# EAGLE design 7seg Display Controller_Rev00 (EAGLE 5.11)
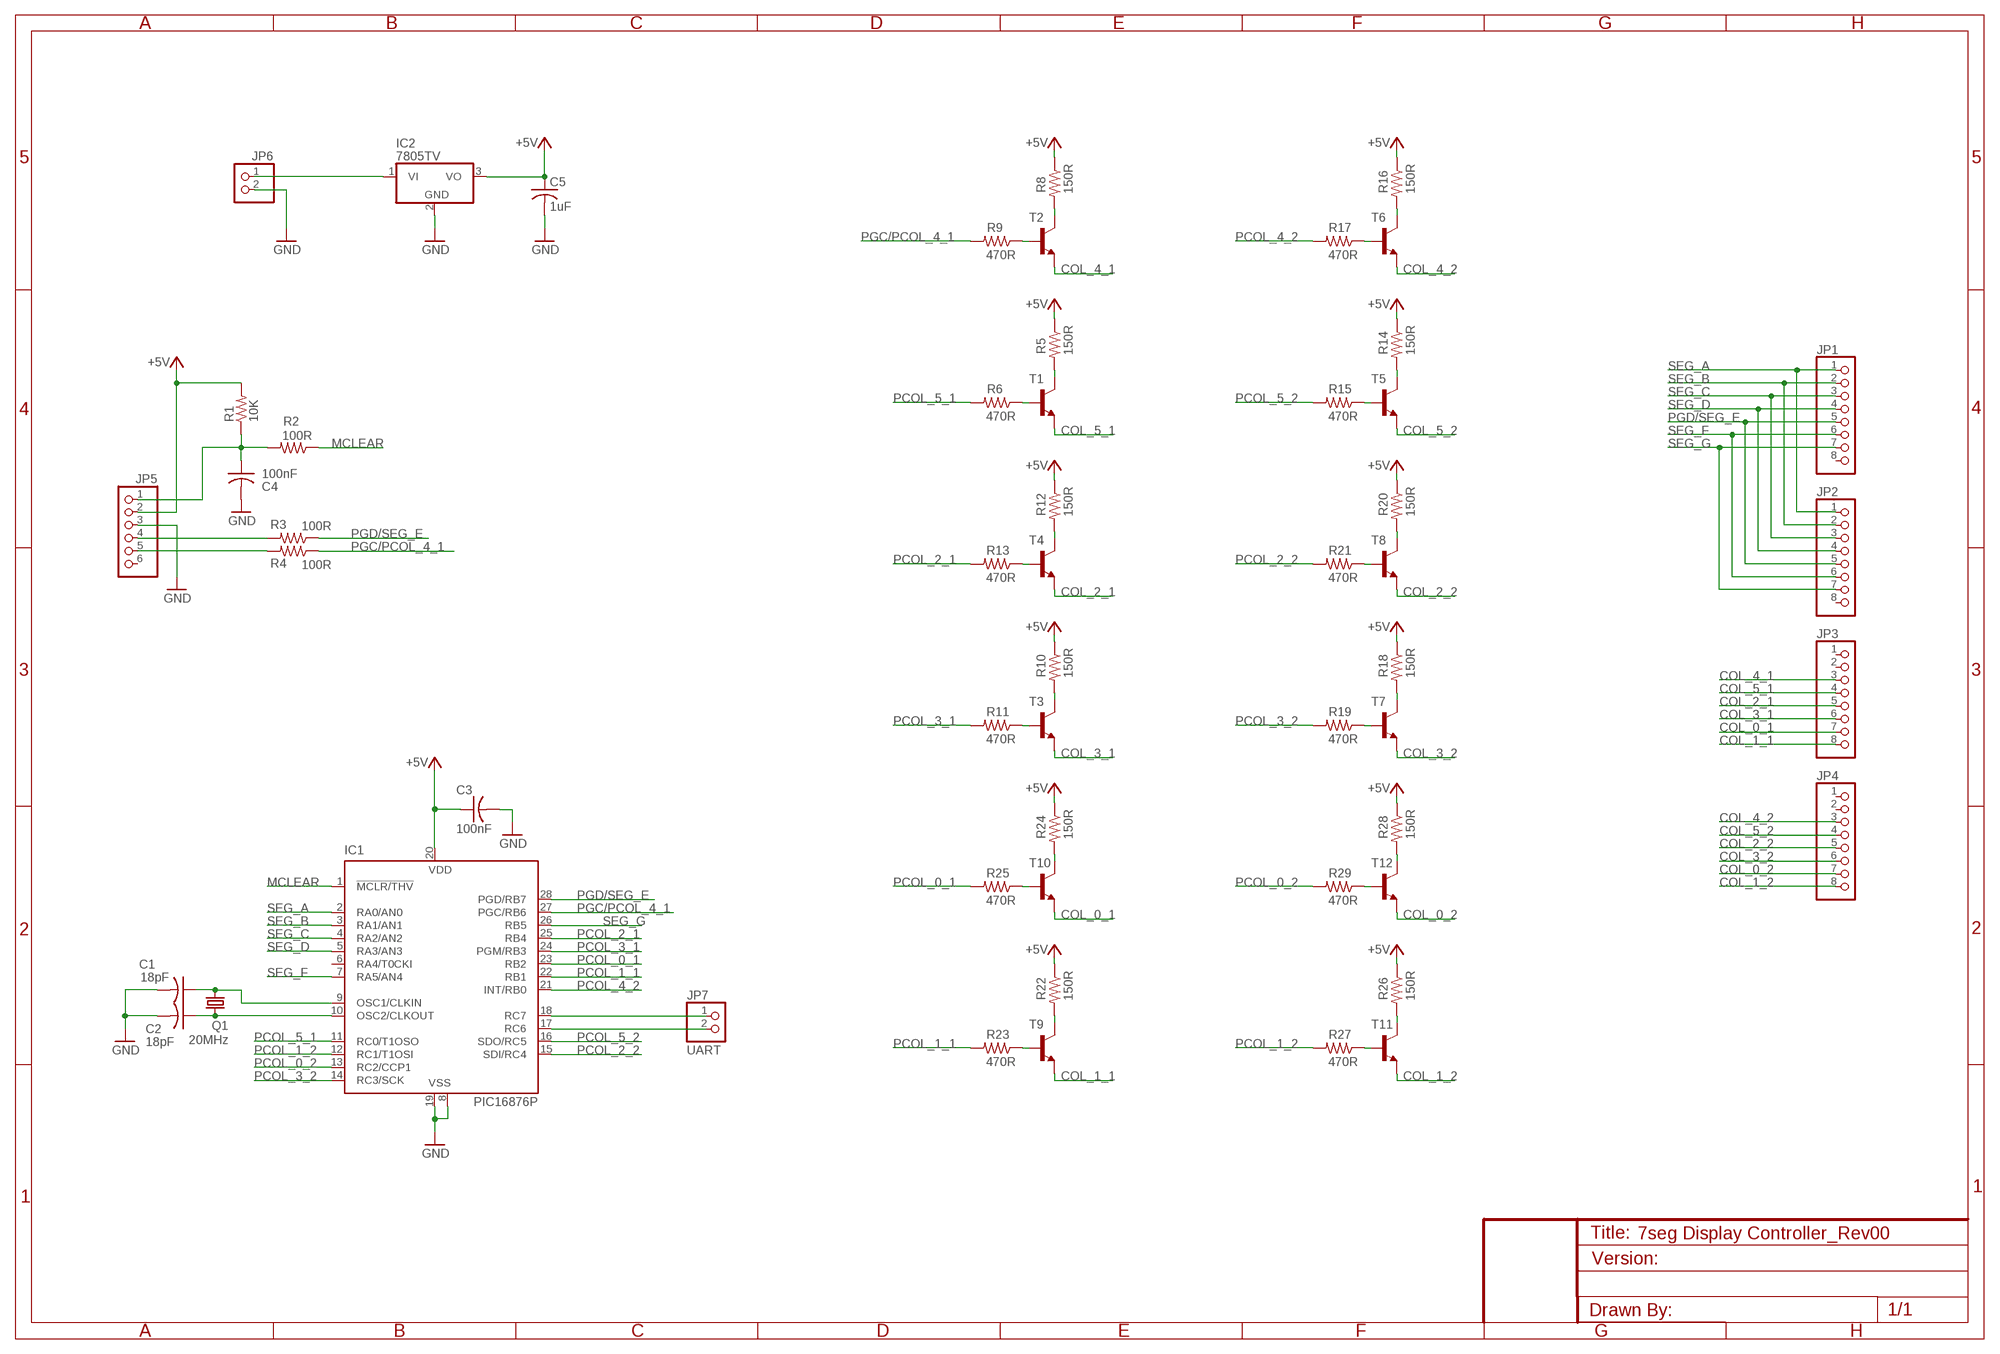
[diagram p0: schematic, sheet 1]

## Parts
C1  18pF  C-USC0805  [C0805]
C2  18pF  C-USC0805  [C0805]
C3  100nF  C-USC0805  [C0805]
C4  100nF  C-USC0805  [C0805]
C5  1uF  C-USC0805  [C0805]
IC1  PIC16876P  [DIL28-3]
IC2  7805TV  [TO220V]
JP1  PINHD-1X8  [1X08]
JP2  PINHD-1X8  [1X08]
JP3  PINHD-1X8  [1X08]
JP4  PINHD-1X8  [1X08]
JP5  PINHD-1X6  [1X06]
JP6  PINHD-1X2  [1X02]
JP7  UART  PINHD-1X2  [1X02]
Q1  20MHz  CRYSTALHC49S  [HC49/S]
R1  10K  R-US_R0805  [R0805]
R2  100R  R-US_R0805  [R0805]
R3  100R  R-US_R0805  [R0805]
R4  100R  R-US_R0805  [R0805]
R5  150R  R-US_R0805  [R0805]
R6  470R  R-US_R0805  [R0805]
R8  150R  R-US_R0805  [R0805]
R9  470R  R-US_R0805  [R0805]
R10  150R  R-US_R0805  [R0805]
R11  470R  R-US_R0805  [R0805]
R12  150R  R-US_R0805  [R0805]
R13  470R  R-US_R0805  [R0805]
R14  150R  R-US_R0805  [R0805]
R15  470R  R-US_R0805  [R0805]
R16  150R  R-US_R0805  [R0805]
R17  470R  R-US_R0805  [R0805]
R18  150R  R-US_R0805  [R0805]
R19  470R  R-US_R0805  [R0805]
R20  150R  R-US_R0805  [R0805]
R21  470R  R-US_R0805  [R0805]
R22  150R  R-US_R0805  [R0805]
R23  470R  R-US_R0805  [R0805]
R24  150R  R-US_R0805  [R0805]
R25  470R  R-US_R0805  [R0805]
R26  150R  R-US_R0805  [R0805]
R27  470R  R-US_R0805  [R0805]
R28  150R  R-US_R0805  [R0805]
R29  470R  R-US_R0805  [R0805]
T1  BC817-16-NPN-SOT23-BEC  [SOT23-BEC]
T2  BC817-16-NPN-SOT23-BEC  [SOT23-BEC]
T3  BC817-16-NPN-SOT23-BEC  [SOT23-BEC]
T4  BC817-16-NPN-SOT23-BEC  [SOT23-BEC]
T5  BC817-16-NPN-SOT23-BEC  [SOT23-BEC]
T6  BC817-16-NPN-SOT23-BEC  [SOT23-BEC]
T7  BC817-16-NPN-SOT23-BEC  [SOT23-BEC]
T8  BC817-16-NPN-SOT23-BEC  [SOT23-BEC]
T9  BC817-16-NPN-SOT23-BEC  [SOT23-BEC]
T10  BC817-16-NPN-SOT23-BEC  [SOT23-BEC]
T11  BC817-16-NPN-SOT23-BEC  [SOT23-BEC]
T12  BC817-16-NPN-SOT23-BEC  [SOT23-BEC]

## Nets
+5V: C3.1 C5.1 IC1.20(VDD) IC2.3(VO) JP5.2 R1.2 R5.1 R8.1 R10.1 R12.1 R14.1 R16.1 R18.1 R20.1 R22.1 R24.1 R26.1 R28.1
COL_0_1: JP3.7 T10.E
COL_0_2: JP4.7 T12.E
COL_1_1: JP3.8 T9.E
COL_1_2: JP4.8 T11.E
COL_2_1: JP3.5 T4.E
COL_2_2: JP4.5 T8.E
COL_3_1: JP3.6 T3.E
COL_3_2: JP4.6 T7.E
COL_4_1: JP3.3 T2.E
COL_4_2: JP4.3 T6.E
COL_5_1: JP3.4 T1.E
COL_5_2: JP4.4 T5.E
GND: C1.2 C2.2 C3.2 C4.2 C5.2 IC1.8(VSS) IC1.19(VSS) IC2.2(GND) JP5.3 JP6.2
MCLEAR: IC1.1(!MCLR/THV) R2.1
N$1: R6.1 T1.B
N$2: R5.2 T1.C
N$3: IC2.1(VI) JP6.1
N$6: IC1.18(RC7) JP7.1
N$7: IC1.17(RC6) JP7.2
N$8: C2.1 IC1.10(OSC2/CLKOUT) Q1.1
N$9: C1.1 IC1.9(OSC1/CLKIN) Q1.2
N$10: C4.1 JP5.1 R1.1 R2.2
N$11: JP5.4 R3.2
N$12: JP5.5 R4.2
N$16: R9.1 T2.B
N$17: R8.2 T2.C
N$18: R11.1 T3.B
N$19: R10.2 T3.C
N$20: R13.1 T4.B
N$21: R12.2 T4.C
N$22: R15.1 T5.B
N$23: R14.2 T5.C
N$24: R17.1 T6.B
N$25: R16.2 T6.C
N$26: R19.1 T7.B
N$27: R18.2 T7.C
N$28: R21.1 T8.B
N$29: R20.2 T8.C
N$30: R23.1 T9.B
N$31: R22.2 T9.C
N$32: R25.1 T10.B
N$33: R24.2 T10.C
N$34: R27.1 T11.B
N$35: R26.2 T11.C
N$36: R29.1 T12.B
N$37: R28.2 T12.C
PCOL_0_1: IC1.23(RB2) R25.2
PCOL_0_2: IC1.13(RC2/CCP1) R29.2
PCOL_1_1: IC1.22(RB1) R23.2
PCOL_1_2: IC1.12(RC1/T1OSI) R27.2
PCOL_2_1: IC1.25(RB4) R13.2
PCOL_2_2: IC1.15(SDI/RC4) R21.2
PCOL_3_1: IC1.24(PGM/RB3) R11.2
PCOL_3_2: IC1.14(RC3/SCK) R19.2
PCOL_4_2: IC1.21(INT/RB0) R17.2
PCOL_5_1: IC1.11(RC0/T1OSO) R6.2
PCOL_5_2: IC1.16(SDO/RC5) R15.2
PGC/PCOL_4_1: IC1.27(PGC/RB6) R4.1 R9.2
PGD/SEG_E: IC1.28(PGD/RB7) JP1.5 JP2.5 R3.1
SEG_A: IC1.2(RA0/AN0) JP1.1 JP2.1
SEG_B: IC1.3(RA1/AN1) JP1.2 JP2.2
SEG_C: IC1.4(RA2/AN2) JP1.3 JP2.3
SEG_D: IC1.5(RA3/AN3) JP1.4 JP2.4
SEG_F: IC1.7(RA5/AN4) JP1.6 JP2.6
SEG_G: IC1.26(RB5) JP1.7 JP2.7
Unconnected: IC1.6(RA4/T0CKI) JP1.8 JP2.8 JP3.1 JP3.2 JP4.1 JP4.2 JP5.6

## Library data of the parts
C1-C5 = adafruit:C-US: CAPACITOR, American symbol
IC1 = microchip:PIC16*876: MICROCONTROLLER flash type; OC_FARNELL: unknown; OC_NEWARK: unknown
IC2 = linear:78*: Positive VOLTAGE REGULATOR Source: http://cache.national.com/ds/LM/LM78L05.pdf http://www.fairchildsemi.com/ds/LM/LM7805.pdf
JP1-JP4 = pinhead:PINHD-1X8: PIN HEADER
JP5 = pinhead:PINHD-1X6: PIN HEADER
JP6 JP7 = pinhead:PINHD-1X2: PIN HEADER
Q1 = crystal:CRYSTAL: CRYSTAL; OC_FARNELL: 1667008; OC_NEWARK: unknown
R1-R6 R8-R29 = adafruit:R-US_: RESISTOR, American symbol
T1-T12 = transistor-neu-to92:*-NPN-: NPN Transistror

## Board
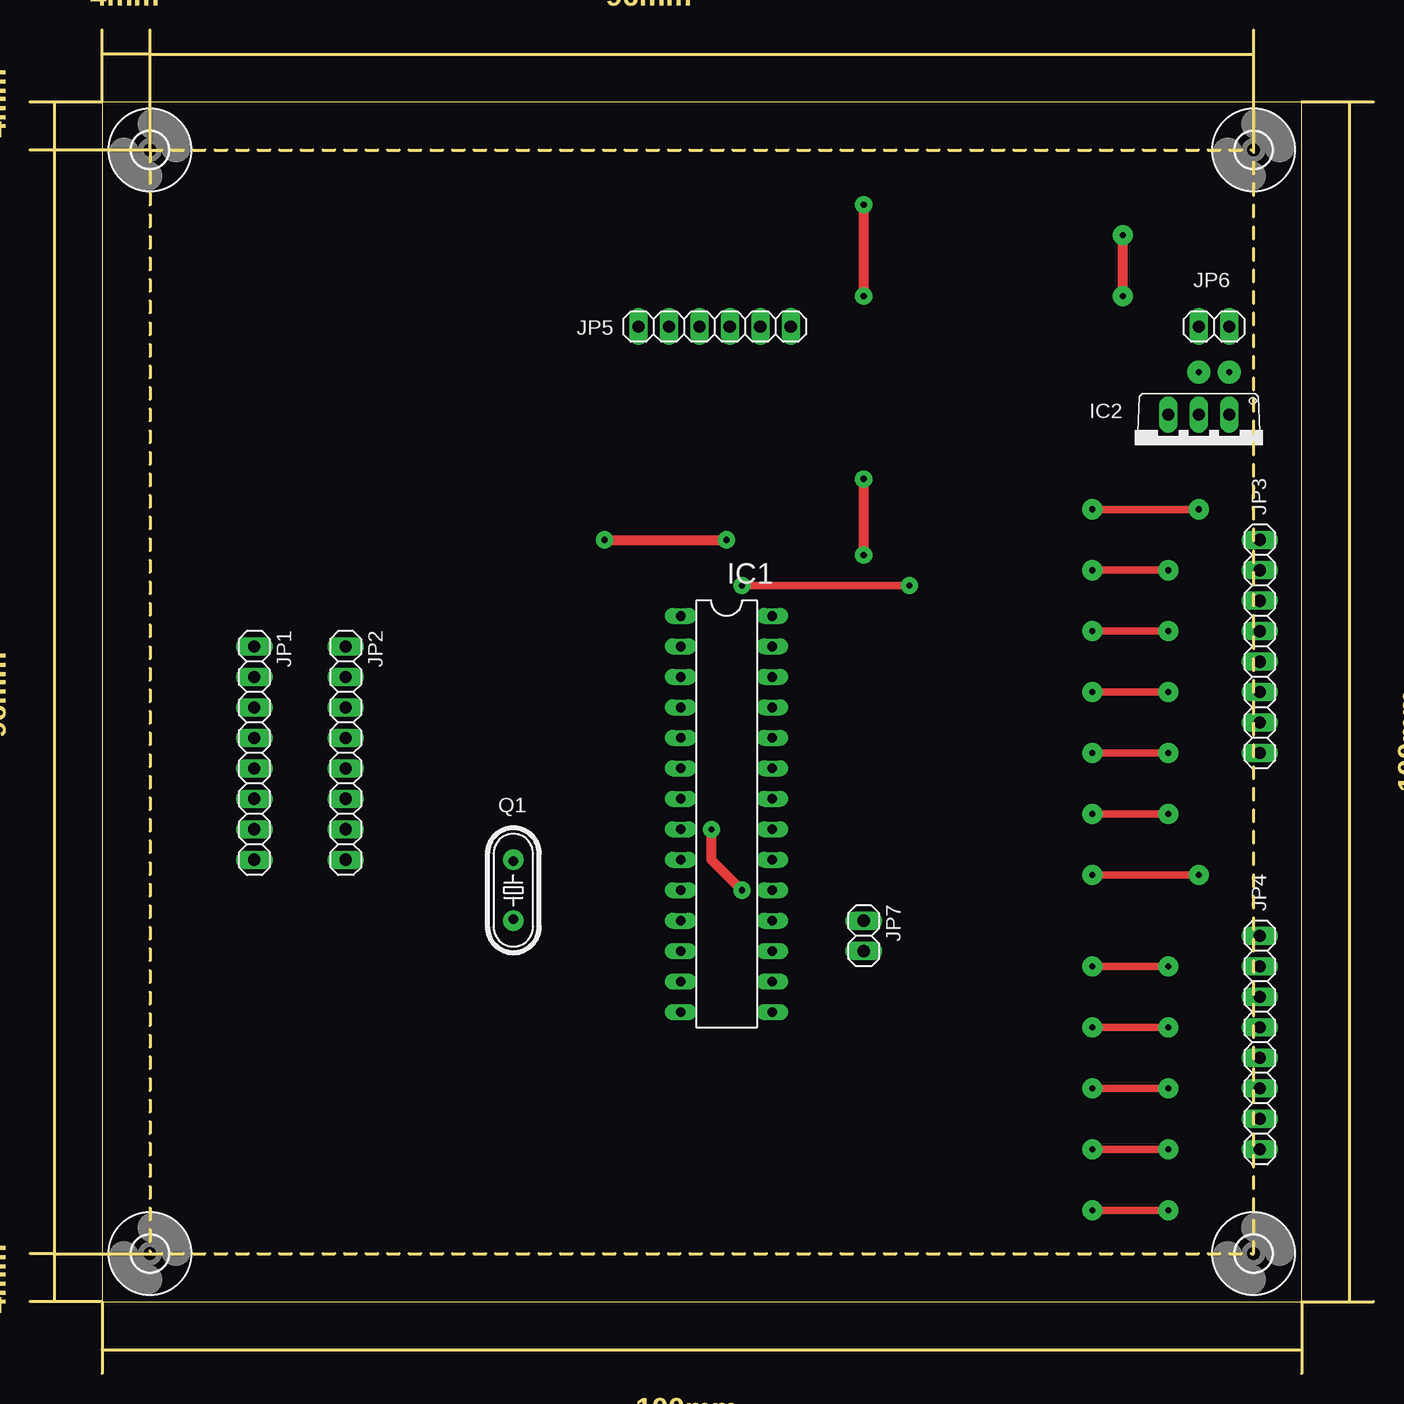
[diagram p1: board, top side]
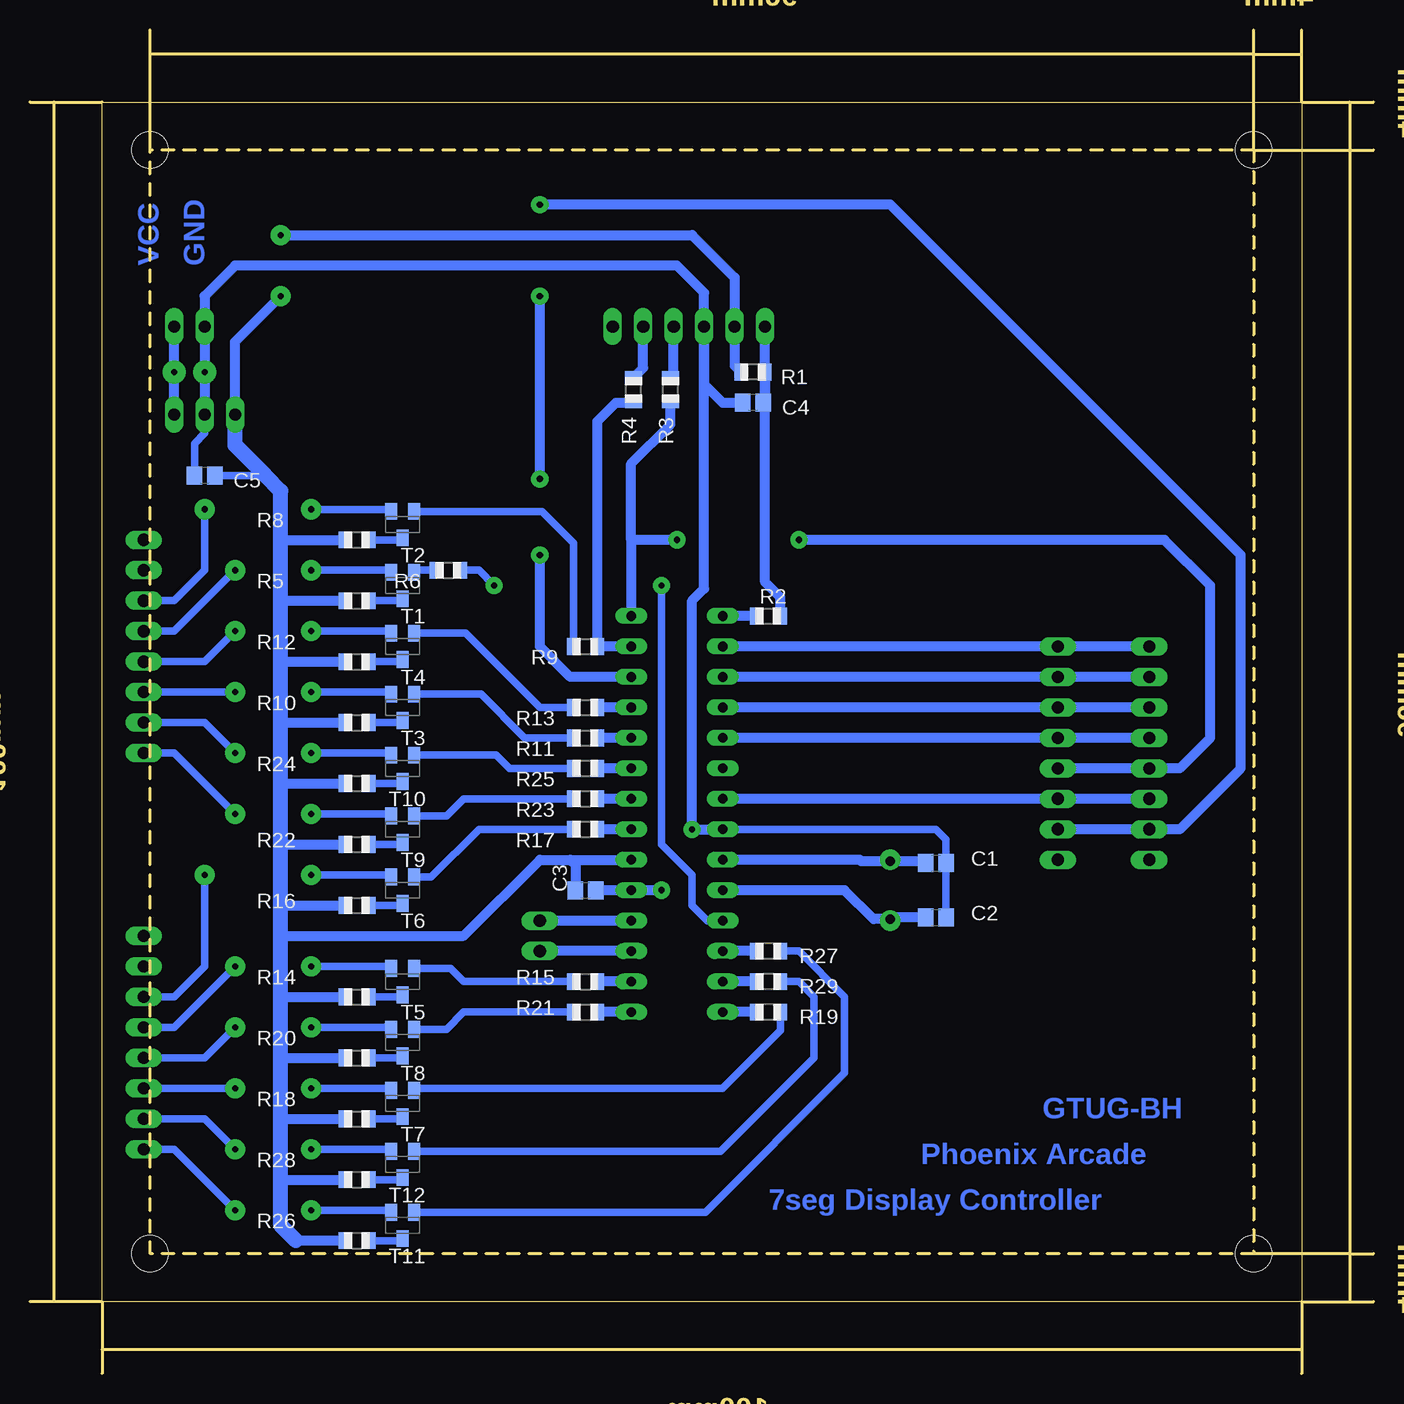
[diagram p2: board, bottom side, seen from below]

Size 112 x 112 mm. Coordinates in mm from the lower left corner, seen from the top.
Outline: 6,6 106,6
Outline: 106,6 106,106
Outline: 106,106 6,106
Outline: 6,106 6,6
Outline: 10,110 102,110
Outline: 10,102 10,110
Outline: 6,106 6,110
Outline: 10,110 6,110
Outline: 102,102 102,112
Outline: 6,106 2,106
Outline: 2,106 2,10
Outline: 2,10 0,10
Outline: 6,6 2,6
Outline: 2,6 0,6
Outline: 2,10 2,6
Outline: 2,106 0,106
Outline: 10,102 0,102
Outline: 10,110 10,112
Outline: 6,110 6,112
Outline: 6,6 6,2
Outline: 6,2 6,0
Outline: 6,2 106,2
Outline: 106,6 106,0
Outline: 106,6 110,6
Outline: 110,6 112,6
Outline: 110,6 110,106
Outline: 112,106 106,106
Outline: 2,10 10,10
Outline: 10,10 102,10 102,102
Outline: 10,102 10,10
Outline: 10,102 102,102
Copper layers (1*16): Top 0.035mm / dielectric 1.5mm / Bottom 0.035mm
Design rules "default": minimum track width 10mil, minimum drill 24mil, track to track 8mil, track to pad 8mil, pad to pad 8mil, via to via 8mil, smd to smd 8mil, copper to edge 40mil, drill to drill 8mil, minimum pad ring 10mil, minimum via ring 8mil, stop-mask expansion 4mil, vias tented up to drill 0mil, thermal gap 10mil

### Footprints (pad centres in the part's own frame; a part is rotated, then mirrored left to right if it is on the bottom)
C0805 = smd 1.3 x 1.5: 1 -0.85,0; 2 0.85,0
DIL28-3 = drill 0.813 long: 1 -16.51,-3.81; 2 -13.97,-3.81; 3 -11.43,-3.81; 4 -8.89,-3.81; 5 -6.35,-3.81; 6 -3.81,-3.81; 7 -1.27,-3.81; 8 1.27,-3.81; 9 3.81,-3.81; 10 6.35,-3.81; 11 8.89,-3.81; 12 11.43,-3.81; 13 13.97,-3.81; 14 16.51,-3.81; 15 16.51,3.81; 16 13.97,3.81; 17 11.43,3.81; 18 8.89,3.81; 19 6.35,3.81; 20 3.81,3.81; 21 1.27,3.81; 22 -1.27,3.81; 23 -3.81,3.81; 24 -6.35,3.81; 25 -8.89,3.81; 26 -11.43,3.81; 27 -13.97,3.81; 28 -16.51,3.81
TO220V = drill 1.016 long: 1 -2.54,-2.54; 2 0,-2.54; 3 2.54,-2.54
1X08 = drill 1.016 long: 1 -8.89,0; 2 -6.35,0; 3 -3.81,0; 4 -1.27,0; 5 1.27,0; 6 3.81,0; 7 6.35,0; 8 8.89,0
1X06 = drill 1.016 long: 1 -6.35,0; 2 -3.81,0; 3 -1.27,0; 4 1.27,0; 5 3.81,0; 6 6.35,0
1X02 = drill 1.016 long: 1 -1.27,0; 2 1.27,0
HC49/S = drill 0.813 round: 1 -2.413,0; 2 2.413,0
R0805 = smd 1.1 x 1.4: 1 -1,0; 2 1,0
SOT23-BEC = smd 1 x 1.4: B -0.95,-1.1; C 0,1.1; E 0.95,-1.1
3,0 = hole 3: 0,0

### Placement (x,y rotation side)
C1  36.48,42.56 0 bottom
C2  36.48,38.02 0 bottom
C3  65.69,40.29 0 bottom
C4  51.72,80.93 180 bottom
C5  97.44,74.85 180 bottom
IC1  58.07,46.64 270 top
IC2  97.44,77.39 180 top
JP1  18.7,51.72 270 top
JP2  26.32,51.72 270 top
JP3  102.52,60.61 270 top
JP4  102.52,27.59 270 top
JP5  57.07,87.28 0 top
JP6  98.71,87.28 180 top
JP7  69.5,36.48 270 top
Q1  40.29,40.29 90 top
R1  51.72,83.47 180 bottom
R2  50.45,63.15 0 bottom
R3  58.61,82.01 90 bottom
R4  61.69,82.01 90 bottom
R5  84.74,64.42 0 bottom
R6  77.12,66.96 0 bottom
R8  84.74,69.5 0 bottom
R9  65.69,60.61 0 bottom
R10  84.74,54.26 0 bottom
R11  65.69,52.99 0 bottom
R12  84.74,59.34 0 bottom
R13  65.69,55.53 0 bottom
R14  84.74,31.4 0 bottom
R15  65.69,32.67 0 bottom
R16  84.74,39.02 0 bottom
R17  65.69,45.37 0 bottom
R18  84.74,21.24 0 bottom
R19  50.45,30.13 180 bottom
R20  84.74,26.32 0 bottom
R21  65.69,30.13 0 bottom
R22  84.74,44.1 0 bottom
R23  65.69,47.91 0 bottom
R24  84.74,49.18 0 bottom
R25  65.69,50.45 0 bottom
R26  84.74,11.08 0 bottom
R27  50.45,35.21 180 bottom
R28  84.74,16.16 0 bottom
R29  50.45,32.67 180 bottom
T1  80.93,65.69 180 bottom
T2  80.93,70.77 180 bottom
T3  80.93,55.53 180 bottom
T4  80.93,60.61 180 bottom
T5  80.93,32.67 180 bottom
T6  80.93,40.29 180 bottom
T7  80.93,22.51 180 bottom
T8  80.93,27.59 180 bottom
T9  80.93,45.37 180 bottom
T10  80.93,50.45 180 bottom
T11  80.93,12.35 180 bottom
T12  80.93,17.43 180 bottom
U$1  [3,0]  10,10 0 top
U$2  [3,0]  102,10 0 top
U$3  [3,0]  102,102 0 top
U$4  [3,0]  10,102 0 top

### Tracks (layer width: path | path; a pad name or v marks a point on that pad's centre or on a via)
+5V  (via drill 0.51 pad 1.68)
  Top 0.813: v91.09,89.82 v91.09,94.9
  Bottom 0.61: 92.36,74.85 C5.1
  Bottom 0.813: R1.2 53.26,84.01 JP5.2 53.26,91.36 56.8,94.9 v91.09,94.9 | R26.1 89.82,11.08 | 91.09,54.26 R10.1 | 91.09,44.1 R22.1 | 91.09,31.4 R14.1 | 91.09,26.32 R20.1 | 91.09,16.16 R28.1 | 66.96,42.83 IC1.20 | C3.1 66.54,42.41 66.96,42.83 | IC2.3 94.9,86.01 v91.09,89.82 | 66.96,42.83 69.5,42.83 75.85,36.48 91.09,36.48 | 91.09,39.02 R16.1 | 91.09,21.24 R18.1 | 91.09,69.5 R8.1 | 91.09,64.42 R5.1 | 91.09,59.34 R12.1 | 91.09,49.18 R24.1
  Bottom 1.27: IC2.3 94.9,77.39 92.36,74.85 91.09,73.58 91.09,69.5 91.09,64.42 91.09,59.34 91.09,54.26 91.09,49.18 91.09,44.1 91.09,39.02 91.09,36.48 91.09,31.4 91.09,26.32 91.09,21.24 91.09,16.16 91.09,12.35 89.82,11.08
COL_0_1  (via drill 0.51 pad 1.68)
  Top 0.61: v88.55,51.72 v94.9,51.72
  Bottom 0.61: JP3.7 97.44,54.26 v94.9,51.72 | v88.55,51.72 82.05,51.72 T10.E
COL_0_2  (via drill 0.51 pad 1.68)
  Top 0.61: v88.55,18.7 v94.9,18.7
  Bottom 0.61: JP4.7 97.44,21.24 v94.9,18.7 | v88.55,18.7 82.05,18.7 T12.E
COL_1_1  (via drill 0.51 pad 1.68)
  Top 0.61: v88.55,46.64 v94.9,46.64
  Bottom 0.61: JP3.8 99.98,51.72 v94.9,46.64 | v88.55,46.64 82.05,46.64 T9.E
COL_1_2  (via drill 0.51 pad 1.68)
  Top 0.61: v88.55,13.62 v94.9,13.62
  Bottom 0.61: JP4.8 99.98,18.7 v94.9,13.62 | v88.55,13.62 82.05,13.62 T11.E
COL_2_1  (via drill 0.51 pad 1.68)
  Top 0.61: v88.55,61.88 v94.9,61.88
  Bottom 0.61: JP3.5 97.44,59.34 v94.9,61.88 | v88.55,61.88 82.05,61.88 T4.E
COL_2_2  (via drill 0.51 pad 1.68)
  Top 0.61: v88.55,28.86 v94.9,28.86
  Bottom 0.61: JP4.5 97.44,26.32 v94.9,28.86 | 82.2,28.86 v88.55,28.86
  Bottom 0.813: T8.E 82.03,28.69 82.2,28.86
COL_3_1  (via drill 0.51 pad 1.68)
  Top 0.61: v88.55,56.8 v94.9,56.8
  Bottom 0.61: v94.9,56.8 JP3.6 | v88.55,56.8 82.05,56.8 T3.E
COL_3_2  (via drill 0.51 pad 1.68)
  Top 0.61: v88.55,23.78 v94.9,23.78
  Bottom 0.61: v94.9,23.78 JP4.6 | v88.55,23.78 82.05,23.78 T7.E
COL_4_1  (via drill 0.51 pad 1.68)
  Top 0.61: v88.55,72.04 v97.44,72.04
  Bottom 0.61: JP3.3 99.98,64.42 97.44,66.96 v97.44,72.04 | v88.55,72.04 82.05,72.04 T2.E
COL_4_2  (via drill 0.51 pad 1.68)
  Top 0.61: v88.55,41.56 v97.44,41.56
  Bottom 0.61: T6.E 82.05,41.56 v88.55,41.56 | v97.44,41.56 97.44,33.94 99.98,31.4 JP4.3
COL_5_1  (via drill 0.51 pad 1.68)
  Top 0.61: v88.55,66.96 v94.9,66.96
  Bottom 0.61: JP3.4 99.98,61.88 v94.9,66.96 | v88.55,66.96 82.05,66.96 T1.E
COL_5_2  (via drill 0.51 pad 1.68)
  Top 0.61: v88.55,33.94 v94.9,33.94
  Bottom 0.61: JP4.4 99.98,28.86 v94.9,33.94 | v88.55,33.94 82.05,33.94 T5.E
GND  (via drill 0.51 pad 1.42, 0.51 pad 1.93)
  Top 0.813: v56.8,45.37 56.8,42.83 v59.34,40.29
  Bottom 0.61: C2.2 C1.2 35.63,44.52 36.48,45.37 IC1.8 | IC2.2 97.44,78.39 98.29,77.54 C5.2
  Bottom 0.813: C4.2 54.26,80.93 55.8,82.47 JP5.3 | IC2.2 v97.44,83.47 JP6.2 97.44,89.82 94.9,92.36 58.07,92.36 55.8,90.09 JP5.3 | C3.2 IC1.19 v59.34,40.29 | JP5.3 55.8,65.42 56.8,64.42 v56.8,45.37 IC1.8
MCLEAR
  Bottom 0.813: R2.1 IC1.1
N$1
  Bottom 0.61: R6.1 79.81,66.96 arc-90 T1.B
N$2
  Bottom 0.61: R5.2 81.1,64.42 T1.C
N$3  (via drill 0.51 pad 1.93)
  Bottom 0.813: IC2.1 v99.98,83.47 JP6.1
N$4  (via drill 0.51 pad 1.68)
  other vias: 40.29,42.83
N$5  (via drill 0.51 pad 1.68)
  other vias: 40.29,37.75
N$6
  Bottom 0.813: IC1.18 JP7.1
N$7
  Bottom 0.813: IC1.17 JP7.2
N$8
  Bottom 0.813: C2.1 40.15,38.02 Q1.1 41.69,37.88 44.1,40.29 IC1.10
N$9
  Bottom 0.813: IC1.9 42.83,42.83 42.7,42.7 Q1.2 37.47,42.7 arc90 C1.1
N$10
  Bottom 0.813: R1.1 JP5.1 | R1.1 50.72,65.96 49.45,64.69 R2.2 | C4.1 50.72,81.08 R1.1
N$11
  Bottom 0.813: R3.2 58.34,83.28 JP5.4
N$12
  Bottom 0.813: R4.2 60.88,83.82 JP5.5
N$16
  Bottom 0.61: T2.B 69.33,71.87 66.69,69.23 R9.1
N$17
  Bottom 0.61: R8.2 81.1,69.5 T2.C
N$18
  Bottom 0.61: T3.B 74.41,56.63 70.77,52.99 R11.1
N$19
  Bottom 0.61: R10.2 81.1,54.26 T3.C
N$20
  Bottom 0.61: T4.B 75.68,61.71 69.5,55.53 R13.1
N$21
  Bottom 0.61: R12.2 81.1,59.34 T4.C
N$22
  Bottom 0.61: R15.1 75.85,32.67 76.95,33.77 T5.B
N$23
  Bottom 0.61: R14.2 81.1,31.4 T5.C
N$24
  Bottom 0.61: R17.1 74.58,45.37 78.56,41.39 T6.B
N$25
  Bottom 0.61: R16.2 81.1,39.02 T6.C
N$26
  Bottom 0.61: T7.B 79.81,23.78 54.26,23.78 49.45,28.59 R19.1
N$27
  Bottom 0.61: R18.2 81.1,21.24 T7.C
N$28
  Bottom 0.61: R21.1 75.85,30.13 77.29,28.69 T8.B
N$29
  Bottom 0.61: R20.2 81.1,26.32 T8.C
N$30
  Bottom 0.61: 79.81,46.64 T9.B 77.29,46.47 75.85,47.91 R23.1
N$31
  Bottom 0.61: R22.2 81.1,44.1 T9.C
N$32
  Bottom 0.61: T10.B 73.14,51.55 72.04,50.45 R25.1
N$33
  Bottom 0.61: R24.2 81.1,49.18 T10.C
N$34
  Bottom 0.61: T11.B 59.34,13.45 58.24,13.45 55.7,13.45 44.1,25.05 44.1,31.4 47.91,35.21 R27.1
N$35
  Bottom 0.61: R26.2 81.1,11.08 T11.C
N$36
  Bottom 0.61: R29.1 47.91,32.67 46.64,31.4 46.64,26.32 54.43,18.53 T12.B
N$37
  Bottom 0.61: R28.2 81.1,16.16 T12.C
PCOL_0_1
  Bottom 0.813: IC1.23 R25.2
PCOL_0_2
  Bottom 0.813: R29.2 IC1.13
PCOL_1_1
  Bottom 0.813: IC1.22 R23.2
PCOL_1_2
  Bottom 0.813: R27.2 IC1.12
PCOL_2_1
  Bottom 0.813: IC1.25 R13.2
PCOL_2_2
  Bottom 0.813: IC1.15 R21.2
PCOL_3_1
  Bottom 0.813: IC1.24 R11.2
PCOL_3_2
  Bottom 0.813: R19.2 IC1.14
PCOL_4_2
  Bottom 0.813: IC1.21 R17.2
PCOL_5_1  (via drill 0.51 pad 1.42)
  Top 0.61: v59.34,65.69 v73.31,65.69
  Bottom 0.61: IC1.11 55.53,37.75 56.8,39.02 56.8,41.56 59.34,44.1 v59.34,65.69 | v73.31,65.69 74.58,66.96 R6.2
PCOL_5_2
  Bottom 0.813: IC1.16 R15.2
PGC/PCOL_4_1
  Bottom 0.813: IC1.27 R9.2 64.69,79.39 63.15,80.93 61.77,80.93 R4.1
PGD/SEG_E  (via drill 0.51 pad 1.42)
  Top 0.813: v47.91,69.5 v58.07,69.5
  Bottom 0.813: R3.1 58.61,79.12 61.88,75.85 61.88,69.5 | 61.88,69.5 IC1.28 | v47.91,69.5 17.43,69.5 13.62,65.69 13.62,52.99 16.16,50.45 JP1.5 JP2.5 | v58.07,69.5 61.88,69.5
SEG_A
  Bottom 0.813: IC1.2 JP2.1 JP1.1
SEG_B
  Bottom 0.813: IC1.3 JP2.2 JP1.2
SEG_C
  Bottom 0.813: IC1.4 JP2.3 JP1.3
SEG_D
  Bottom 0.813: IC1.5 JP2.4 JP1.4
SEG_F
  Bottom 0.813: IC1.7 JP2.6 JP1.6
SEG_G  (via drill 0.51 pad 1.42)
  Top 0.813: v69.5,68.23 v69.5,74.58 | v69.5,89.82 v69.5,97.44
  Bottom 0.813: v69.5,97.44 40.29,97.44 11.08,68.23 11.08,50.45 16.16,45.37 JP1.7 JP2.7 | IC1.26 66.96,58.07 69.5,60.61 v69.5,68.23 | v69.5,74.58 v69.5,89.82

### Text on the board
Bottom: GND | VCC | GTUG-BH | Phoenix Arcade | 7seg Display Controller
Dimension: 4mm | 96mm | 4mm | 100mm | 96mm | 4mm | 100mm